# Altium schematic sheet SmartSocket V1.0.SchDoc (part 2 of 3)
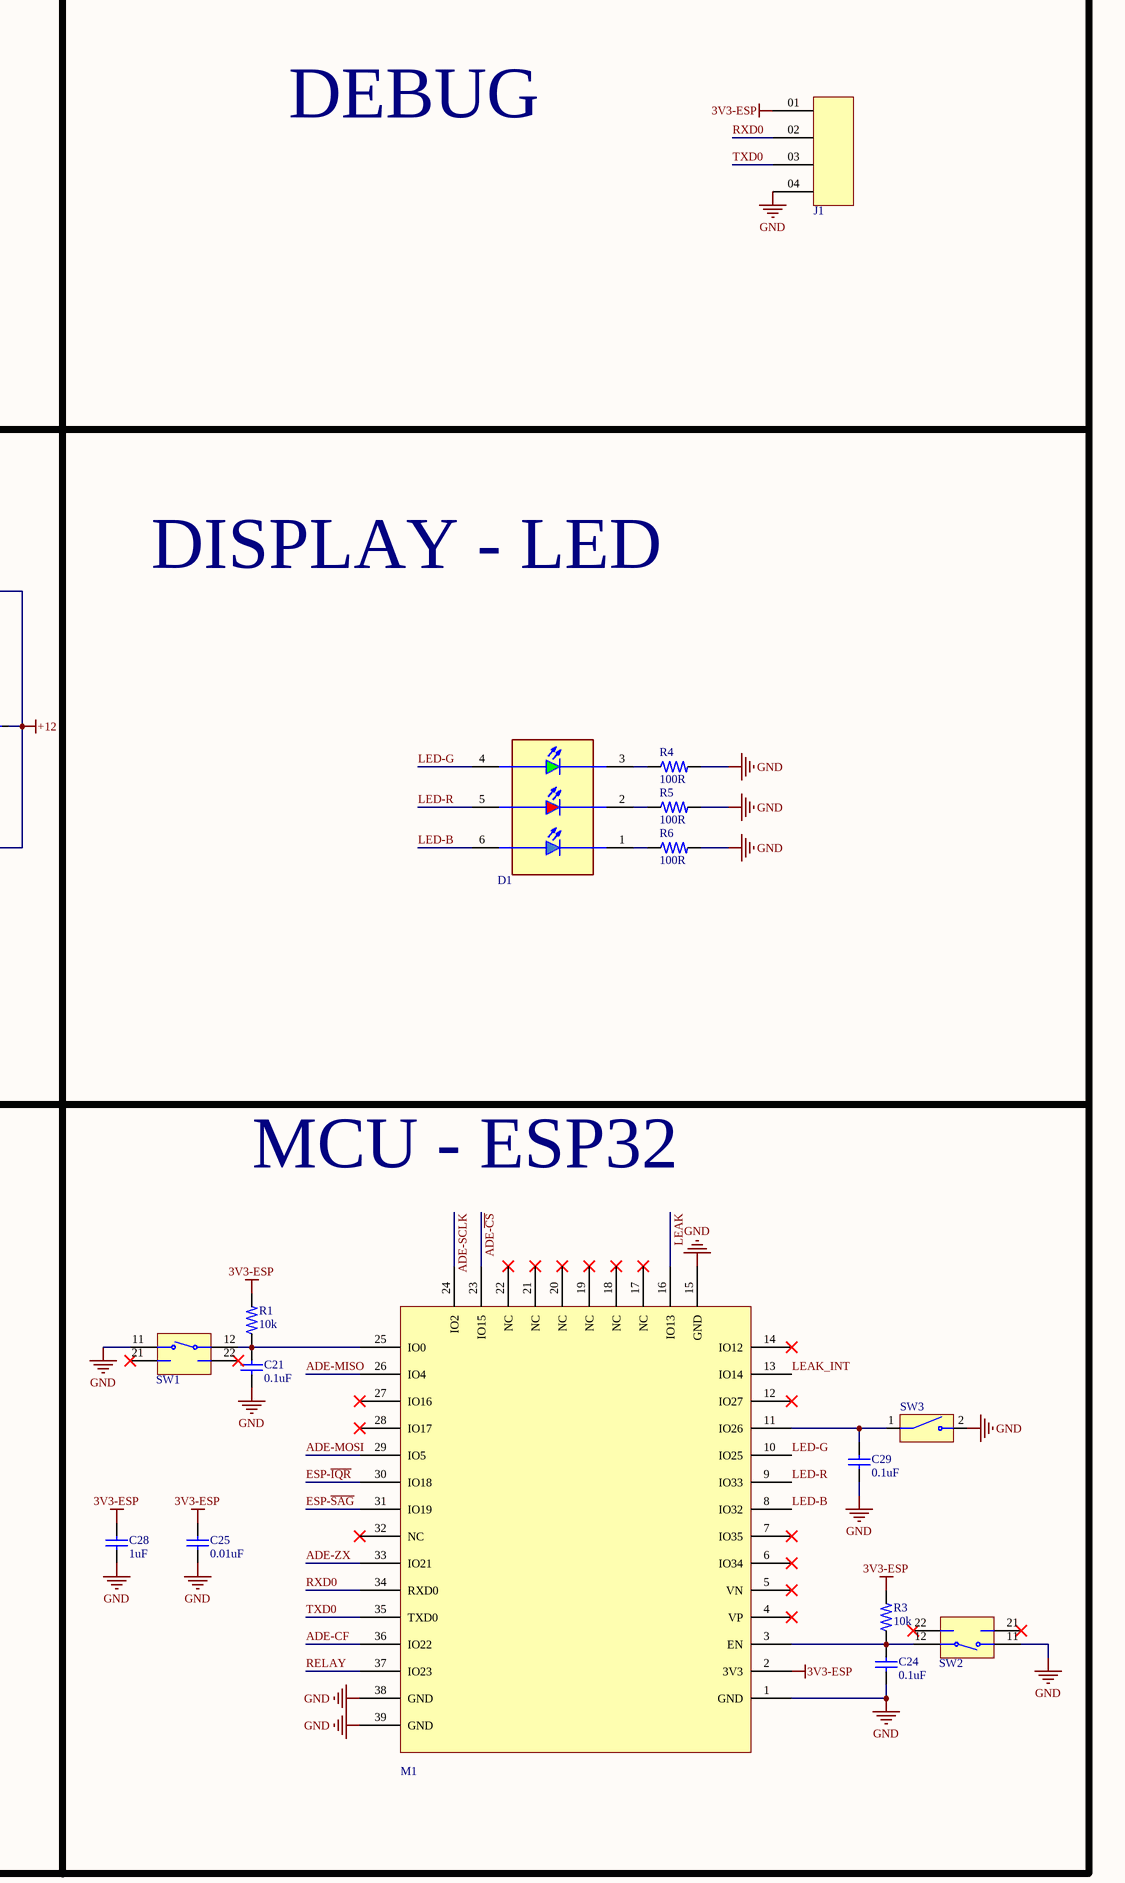
[diagram p2: SmartSocket V1.0.SchDoc, right]
## Library data of the parts
C1 C5 = CAP; 220uF; 16V; SMD; 16SVPK220M: Cap Aluminum Polymer 220uF 16VDC 20% (6.3 X 5.9mm) SMD 0.022 Ohm 1040mA 1000h 125C T/R; Manufacturer: Panasonic; Voltage Rating: 16V; ESR (Equivalent Series Resistance): 22mR; Dissipation Factor: 12%; Leakage Current: 704uA; Ripple Current: 3.3A; Designer: TVBac; Supplier: Mouser; Supplier Part Number: 667-16SVPK220M; Manufacturer Part Number: 16SVPK220M; RoHS: Yes; Category: Polymer Capacitors; Stock: 2355; Pricing: 1=1.29, 10=0.794, 50=0.794, 100=0.723, 1000=0.489, 10000=0.45 (USD); Mounting Technology: Surface Mount; Case/Package: Radial; Material: Polymer; Min Operating Temperature: -55°C; Max Operating Temperature: 125°C; Packaging: Cut Tape; Tolerance: 20%; Series: OS-CON™, SVPK; Voltage Rating (DC): 16V; Height: 6mm; ComponentLink1URL: https://industrial.panasonic.com/cdbs/www-data/pdf/AAB8000/AAB8000C226.pdf?src-supplier=Digikey; ComponentLink1Description: https://industrial.panasonic.com/cdbs/www-data/pdf/AAB8000/AAB8000C226.pdf?src-supplier=Digikey; ComponentLink2URL: https://datasheet.octopart.com/16SVPK220M-Panasonic-datasheet-136612383.pdf?src-supplier=Element14; ComponentLink2Description: https://datasheet.octopart.com/16SVPK220M-Panasonic-datasheet-136612383.pdf?src-supplier=Element14; ComponentLink3URL: https://datasheet.octopart.com/16SVPK220M-Panasonic-datasheet-142271499.pdf?src-supplier=Electro+Sonic; ComponentLink3Description: https://datasheet.octopart.com/16SVPK220M-Panasonic-datasheet-142271499.pdf?src-supplier=Electro+Sonic; ComponentLink4URL: https://datasheet.octopart.com/16SVPK220M-Panasonic-datasheet-151949914.pdf?src-supplier=TME; ComponentLink4Description: https://datasheet.octopart.com/16SVPK220M-Panasonic-datasheet-151949914.pdf?src-supplier=TME; ComponentLink5Description: Link Digikey; ComponentLink5URL: https://www.digikey.com/en/products/detail/panasonic-electronic-components/16SVPK220M/9765095
C2 = CAP; 0.1uF; 50V; 0603; SMD; CC0603JRX7R9BB104: Multilayer Ceramic Capacitor, 0.1 uF, 50 V, ï¿½ 5%, X7R, 0603 [1608 Metric]; Manufacturer: Yageo; Material: 4241ConductorMaterial; Designer: TVBac; Supplier: Digikey; Supplier Part Number: 311-1779-1-ND; Manufacturer Part Number: CC0603JRX7R9BB104; RoHS: Yes; Category: Ceramic Capacitors; Stock: 376318; Pricing: 1=0.1, 10=0.07, 50=0.04, 100=0.031, 500=0.02334, 1000=0.01833, 4000=0.01533, 8000=0.014, 12000=0.01333, 28000=0.01267, 100000=0.00917, 200000=0.00887, 400000=0.00833 (USD); Pins: 2NUMBER; Lead Free: 5697LeadFree; Halogen Free: 5694HalogenFree; ComponentLink1URL: https://datasheet.ciiva.com/11465/upy-gphc-x7r-6-3v-to-50v-8-11465038.pdf?src-supplier=Avnet; ComponentLink1Description: https://datasheet.ciiva.com/11465/upy-gphc-x7r-6-3v-to-50v-8-11465038.pdf?src-supplier=Avnet; ComponentLink2Description: Link Digikey; ComponentLink2URL: https://www.digikey.com/en/products/detail/yageo/CC0603JRX7R9BB104/5195188
C3 C4 = CAP; TH; 2.2uF; 400V; ECA-2GM2R2: Cap Aluminum Lytic 2.2uF 400V 20% (8 X 11.5mm) Radial 3.5mm 50mA 2000h 85C Automotive Bulk; Manufacturer: Panasonic; Designer: TVBac; Supplier: Mouser; Supplier Part Number: 667-ECA-2GM2R2; Manufacturer Part Number: ECA-2GM2R2; RoHS: Yes; Category: Aluminum Electrolytic Capacitors; Stock: 1247; Pricing: 1=0.45, 10=0.221, 50=0.221, 100=0.142, 1000=0.119, 10000=0.096 (USD); Pins: 2NUMBER; Lead Free: 5697LeadFree; ComponentLink1URL: https://datasheet.ciiva.com/48522/radial-m-eng-tds-48522426.pdf?src-supplier=Distrelec; ComponentLink1Description: https://datasheet.ciiva.com/48522/radial-m-eng-tds-48522426.pdf?src-supplier=Distrelec; ComponentLink2Description: Link Digikey; ComponentLink2URL: https://www.digikey.com/en/products/detail/panasonic-electronic-components/ECA-2GM2R2/2688912
C6 C17 C27 = CAP; CAP_TAN; 10uF; 10V; T491A106M010AT: Capacitor, Tantalum, Solid, Polarized, 10 V, 10 Uf, Surface Mount, 1206, Lead Free; Manufacturer: KEMET; Tolerance: 20%; ESR (Equivalent Series Resistance): 4R; Voltage Rating: 10V; Leakage Current: 1uA; Polarity: Polar; Dissipation Factor: 6%; Ripple Current: 137mA; Designer: TVBac; Supplier: Mouser; Supplier Part Number: 80-T491A106M010; Manufacturer Part Number: T491A106M010AT; RoHS: Yes; Category: Tantalum Capacitors; Stock: 78299; Pricing: 1=0.29, 10=0.152, 50=0.152, 100=0.098, 1000=0.083, 2000=0.076, 10000=0.071, 50000=0.069 (USD); Mounting Technology: Surface Mount,PCB; Case/Package: 1206; Pins: 2; Case Code (Metric): 3216; Case Code (Imperial): 1206; Weight: 0.000571oz; Dielectric Material: Tantalum; Min Operating Temperature: -55°C; Max Operating Temperature: 125°C; Packaging: Tape and Reel; Voltage Rating (DC): 10V; Termination: SMD/SMT; Voltage: 10V; Features: General Purpose; Series: T491; Construction: Flat; Length: 3.2mm; Width: 1.6mm; Height: 1.6mm; Depth: 1.6mm; Lead Pitch: 1.2mm; Size: 1.6mm; Reach SVHC Compliant: No; Lead Free: Lead Free; RoHS Compliant: Yes; ComponentLink1URL: https://datasheet.ciiva.com/27052/1573273-27052561.pdf?src-supplier=Jameco; ComponentLink1Description: https://datasheet.ciiva.com/27052/1573273-27052561.pdf?src-supplier=Jameco; ComponentLink2URL: https://datasheet.ciiva.com/257/kem-t2005-t491-257587.pdf?src-supplier=Digikey; ComponentLink2Description: https://datasheet.ciiva.com/257/kem-t2005-t491-257587.pdf?src-supplier=Digikey; ComponentLink3URL: https://datasheet.ciiva.com/7668/kem-t2005-t491-7668140.pdf?src-supplier=Element14; ComponentLink3Description: https://datasheet.ciiva.com/7668/kem-t2005-t491-7668140.pdf?src-supplier=Element14; ComponentLink4URL: https://datasheet.ciiva.com/257/kem-t2005-t491-257588.pdf?src-supplier=Digikey; ComponentLink4Description: https://datasheet.ciiva.com/257/kem-t2005-t491-257588.pdf?src-supplier=Digikey; ComponentLink5URL: https://datasheet.ciiva.com/257/kem-t2005-t491-257589.pdf?src-supplier=Digikey; ComponentLink5Description: https://datasheet.ciiva.com/257/kem-t2005-t491-257589.pdf?src-supplier=Digikey; ComponentLink6URL: https://datasheet.ciiva.com/14601/70095774-14601994.pdf?src-supplier=Allied+Electronics; ComponentLink6Description: https://datasheet.ciiva.com/14601/70095774-14601994.pdf?src-supplier=Allied+Electronics; ComponentLink7URL: https://datasheet.ciiva.com/14602/70095774-14602172.pdf?src-supplier=Allied+Electronics; ComponentLink7Description: https://datasheet.ciiva.com/14602/70095774-14602172.pdf?src-supplier=Allied+Electronics; ComponentLink8URL: https://datasheet.ciiva.com/12910/kem-t2005-t491-12910559.pdf?src-supplier=Mouser; ComponentLink8Description: https://datasheet.ciiva.com/12910/kem-t2005-t491-12910559.pdf?src-supplier=Mouser; ComponentLink9Description: Link Digikey; ComponentLink9URL: https://www.digikey.com/en/products/detail/kemet/T491A106M010AT/818547
C7 = CAP; 220uF; 10V; SMD; 10SVPE220M: Cap Aluminum Polymer 220uF 10VDC 20%( 6.3 X 5.9mm) SMD 0.02 Ohm 2700mA 2000h 105C T/R; Manufacturer: Panasonic; Voltage Rating: 10V; ESR (Equivalent Series Resistance): 20mR; Ripple Current: 2.7A; Leakage Current: 500uA; Life (Hours): 2000Hour; Dissipation Factor: 12%; Designer: TVBac; Supplier: Mouser; Supplier Part Number: 667-10SVPE220M; Manufacturer Part Number: 10SVPE220M; RoHS: Yes; Category: Polymer Capacitors; Stock: 1969; Pricing: 1=1.66, 10=1.53, 50=1.44, 100=1.19, 1000=0.857, 10000=0.768 (USD); Mounting Technology: Surface Mount; Case/Package: Radial; Pins: 6; Min Operating Temperature: -55°C; Max Operating Temperature: 105°C; Package Quantity: 1000; Packaging: Tape and Reel; Tolerance: 20%; Voltage Rating (DC): 10V; Ripple Current (AC): 2.7A; Termination: SMD/SMT; Voltage: 10V; Series: OS-CON™, SVPE; Construction: Cylindrical; Diameter: 6.3mm; Length: 5.9mm; Height: 5.9mm; Reach SVHC Compliant: No; Lead Free: Lead Free; RoHS Compliant: Yes; ComponentLink1URL: https://datasheet.ciiva.com/25767/1734359-25767468.pdf?src-supplier=Farnell; ComponentLink1Description: https://datasheet.ciiva.com/25767/1734359-25767468.pdf?src-supplier=Farnell; ComponentLink2URL: https://datasheet.ciiva.com/22746/1734359-22746158.pdf?src-supplier=Element14; ComponentLink2Description: https://datasheet.ciiva.com/22746/1734359-22746158.pdf?src-supplier=Element14; ComponentLink3Description: Link Digikey; ComponentLink3URL: https://www.digikey.com/en/products/detail/panasonic-electronic-components/10SVPE220M/4204777
C8 C9 C18 = CAP; 0.1uF; 16V; 0603; SMD; CC0603KRX7R7BB104: 0603 0.1 uF 16 V ±10 % Tolerance X7R SMT Multilayer Ceramic Capacitor; Manufacturer: Yageo; Insulation Resistance: 100GR; Designer: TVBac; Supplier: Digikey; Supplier Part Number: 311-1088-1-ND; Manufacturer Part Number: CC0603KRX7R7BB104; RoHS: Yes; Category: Ceramic Capacitors; Stock: 8705780; Pricing: 1=0.1, 10=0.042, 50=0.0238, 100=0.0185, 500=0.01392, 1000=0.01094, 4000=0.00915, 8000=0.00836, 12000=0.00796, 28000=0.00756, 100000=0.00547, 200000=0.00529, 400000=0.00497 (USD); Mounting Technology: Surface Mount; Case/Package: 0603; Pins: 2; Case Code (Metric): 1608; Case Code (Imperial): 0603; Material: Ceramic; Min Operating Temperature: -55°C; Max Operating Temperature: 125°C; Voltage Rating: 16V; Tolerance: 10%; Voltage Rating (DC): 16V; Package Quantity: 1; Packaging: Tape and Reel; Dielectric: X7R; Termination: SMD/SMT; Voltage: 16V; Series: CC; Length: 1.6mm; Width: 0.031inch; Height: 0.8mm; Thickness: 0.035inch; Depth: 0.8mm; Radiation Hardening: No; Reach SVHC Compliant: No; Lead Free: Lead Free; Halogen Free: Halogen Free; RoHS Compliant: Yes; ComponentLink1URL: https://datasheet.ciiva.com/11786/0900766b80d84f1d-11786077.pdf?src-supplier=Rs; ComponentLink1Description: https://datasheet.ciiva.com/11786/0900766b80d84f1d-11786077.pdf?src-supplier=Rs; ComponentLink2URL: https://datasheet.ciiva.com/8033/70765-8033799.pdf?src-supplier=Element14; ComponentLink2Description: https://datasheet.ciiva.com/8033/70765-8033799.pdf?src-supplier=Element14; ComponentLink3URL: https://datasheet.ciiva.com/7978/1489800-7978141.pdf?src-supplier=Element14; ComponentLink3Description: https://datasheet.ciiva.com/7978/1489800-7978141.pdf?src-supplier=Element14; ComponentLink4URL: https://datasheet.ciiva.com/28450/1489800-28450552.pdf?src-supplier=Element14; ComponentLink4Description: https://datasheet.ciiva.com/28450/1489800-28450552.pdf?src-supplier=Element14; ComponentLink5URL: https://datasheet.ciiva.com/46430/1734573-46430156.pdf?src-supplier=Element14; ComponentLink5Description: https://datasheet.ciiva.com/46430/1734573-46430156.pdf?src-supplier=Element14; ComponentLink6URL: https://datasheet.ciiva.com/144/mlccorderingcode-144183.pdf?src-supplier=Digikey; ComponentLink6Description: https://datasheet.ciiva.com/144/mlccorderingcode-144183.pdf?src-supplier=Digikey; ComponentLink7URL: https://datasheet.ciiva.com/144/mlccorderingcode-144182.pdf?src-supplier=Digikey; ComponentLink7Description: https://datasheet.ciiva.com/144/mlccorderingcode-144182.pdf?src-supplier=Digikey; ComponentLink8URL: https://datasheet.ciiva.com/144/mlccorderingcode-144184.pdf?src-supplier=Digikey; ComponentLink8Description: https://datasheet.ciiva.com/144/mlccorderingcode-144184.pdf?src-supplier=Digikey; ComponentLink9URL: https://datasheet.ciiva.com/8033/1734573-8033797.pdf?src-supplier=Element14; ComponentLink9Description: https://datasheet.ciiva.com/8033/1734573-8033797.pdf?src-supplier=Element14; ComponentLink10URL: https://datasheet.ciiva.com/13395/upy-gphc-x7r-6-3v-to-50v-8-13395674.pdf?src-supplier=Mouser; ComponentLink10Description: https://datasheet.ciiva.com/13395/upy-gphc-x7r-6-3v-to-50v-8-13395674.pdf?src-supplier=Mouser; ComponentLink11URL: https://datasheet.ciiva.com/11464/upy-gphc-x7r-6-3v-to-50v-8-11464735.pdf?src-supplier=Avnet; ComponentLink11Description: https://datasheet.ciiva.com/11464/upy-gphc-x7r-6-3v-to-50v-8-11464735.pdf?src-supplier=Avnet; ComponentLink12URL: https://datasheet.ciiva.com/15165/getdatasheetpartid-63554-15165387.pdf?src-supplier=Verical; ComponentLink12Description: https://datasheet.ciiva.com/15165/getdatasheetpartid-63554-15165387.pdf?src-supplier=Verical; ComponentLink13Description: Link Digikey; ComponentLink13URL: https://www.digikey.com/en/products/detail/yageo/CC0603KRX7R7BB104/302822
C10 C13 = CAP; 22pF; 50V; SMD; CC0603FRNPO9BN220: Multilayer Ceramic Capacitor, 22 pF, 50 V, ï¿½ 1%, C0G (NP0), 0603 [1608 Metric]; Manufacturer: Yageo; Designer: TVBac; Supplier: Future Electronics; Supplier Part Number: 1000074; Manufacturer Part Number: CC0603FRNPO9BN220; RoHS: Yes; Category: Ceramic Capacitors; Stock: 144000; Pricing: 4000=0.0159, 12000=0.0156, 20000=0.0154, 80000=0.0149, 120000=0.0147 (USD); Lead Free: 5697LeadFree; Halogen Free: 5694HalogenFree; ComponentLink1URL: https://datasheet.ciiva.com/13211/upy-gp-np0-16v-to-50v-8-13211061.pdf?src-supplier=Mouser; ComponentLink1Description: https://datasheet.ciiva.com/13211/upy-gp-np0-16v-to-50v-8-13211061.pdf?src-supplier=Mouser; ComponentLink2Description: Link Digikey; ComponentLink2URL: https://www.digikey.com/en/products/detail/yageo/CC0603FRNPO9BN220/5883497
C11 C12 C14-C16 C19 = CAP; 0.033uF; 33nF; 0603; 16V; C0603C333J4REC7411: Multilayer Ceramic Capacitors MLCC - SMD/SMT 16V 0.033uF X7R 0603 5%; Manufacturer: KEMET; Designer: TVBac; Supplier: Mouser; Supplier Part Number: 80-C0603C333J4RECLR; Manufacturer Part Number: C0603C333J4REC7411; RoHS: Yes; Category: Ceramic Capacitors; Stock: 17910; Pricing: 1=0.13, 10=0.057, 50=0.057, 100=0.033, 1000=0.025, 2500=0.022, 10000=0.02, 15000=0.018, 45000=0.017, 90000=0.014 (USD); ComponentLink1URL: https://api.kemet.com/component-edge/download/datasheet/C0603C333J4REC7411.pdf?src-supplier=Digikey; ComponentLink1Description: https://api.kemet.com/component-edge/download/datasheet/C0603C333J4REC7411.pdf?src-supplier=Digikey; ComponentLink2Description: Link Digikey; ComponentLink2URL: https://www.digikey.com/en/products/detail/kemet/C0603C333J4REC7411/8645086
C20 = CAP; 10uF; 10V; 0805; C0805C106K9PACTU: Multilayer Ceramic Capacitor, 10 uF, 6.3 V, ï¿½ 10%, X5R, 0805 [2012 Metric]; Manufacturer: KEMET; Material: 4241ConductorMaterial; Dissipation Factor: 5%; Designer: TVBac; Supplier: Mouser; Supplier Part Number: 80-C0805C106K9P; Manufacturer Part Number: C0805C106K9PACTU; RoHS: Yes; Category: Ceramic Capacitors; Stock: 133022; Pricing: 1=0.12, 10=0.074, 50=0.074, 100=0.044, 1000=0.033, 3000=0.026, 9000=0.025, 10000=0.025, 24000=0.023, 45000=0.022, 99000=0.019 (USD); Mounting Technology: Surface Mount; Case/Package: 0805; Pins: 2; Case Code (Imperial): 0805; Case Code (Metric): 2012; Contact Material: Tin; Dielectric Material: 4241ConductorMaterial; Min Operating Temperature: -55°C; Max Operating Temperature: 85°C; Tolerance: 10%; Packaging: Tape and Reel; Package Quantity: 3000; Voltage Rating: 6.3V; Voltage Rating (DC): 6.3V; Dielectric: X5R; Termination: SMD/SMT; Series: SMD Comm X5R; Construction: Flat; Voltage Rating (AC): 6.3V; Length: 2mm; Width: 1.2mm; Height: 1.25mm; Depth: 1.25mm; Lead Pitch: 0.75mm; Radiation Hardening: No; Reach SVHC Compliant: No; RoHS Compliant: Yes; Lead Free: 5697LeadFree; ComponentLink1URL: https://datasheet.ciiva.com/7842/kem-c1006-x5r-smd-7842200.pdf?src-supplier=Element14; ComponentLink1Description: https://datasheet.ciiva.com/7842/kem-c1006-x5r-smd-7842200.pdf?src-supplier=Element14; ComponentLink2URL: https://datasheet.ciiva.com/7842/kem-c1006-x5r-smd-7842201.pdf?src-supplier=Element14; ComponentLink2Description: https://datasheet.ciiva.com/7842/kem-c1006-x5r-smd-7842201.pdf?src-supplier=Element14; ComponentLink3URL: https://datasheet.ciiva.com/18193/getdatasheetpartid-320652-18193500.pdf?src-supplier=Verical; ComponentLink3Description: https://datasheet.ciiva.com/18193/getdatasheetpartid-320652-18193500.pdf?src-supplier=Verical; ComponentLink4Description: Link Digikey; ComponentLink4URL: https://www.digikey.com/en/products/detail/kemet/C0805C106K9PAC7800/551604
C21 C24 C29 = CAP; 0.1uF; 25V; 0603; SMD; CC0603JRX7R8BB104: Multilayer Ceramic Capacitor, 0.1 uF, 25 V, ï¿½ 5%, X7R, 0603 [1608 Metric]; Manufacturer: Yageo; Designer: TVBac; Supplier: Digikey; Supplier Part Number: 311-1777-1-ND; Manufacturer Part Number: CC0603JRX7R8BB104; RoHS: Yes; Category: Ceramic Capacitors; Stock: 449287; Pricing: 1=0.1, 10=0.068, 50=0.0408, 100=0.0321, 500=0.02372, 1000=0.01964, 4000=0.01672, 8000=0.01555, 12000=0.01478, 28000=0.014, 100000=0.0106, 200000=0.01034, 400000=0.00972 (USD); Mounting Technology: Surface Mount; Case/Package: 0603; Case Code (Imperial): 0603; Case Code (Metric): 1608; Weight: 7.1E-05oz; Min Operating Temperature: -55°C; Max Operating Temperature: 125°C; Voltage Rating: 25V; Voltage Rating (DC): 25V; Tolerance: 5%; Packaging: Tape and Reel; Dielectric: X7R; Termination: SMD/SMT; Series: CC; Construction: Flat; Length: 1.6mm; Width: 0.031inch; Height: 0.8mm; Thickness: 0.035inch; Lead Free: Lead Free; Halogen Free: Halogen Free; RoHS Compliant: Yes; ComponentLink1URL: https://datasheet.ciiva.com/11465/upy-gphc-x7r-6-3v-to-50v-8-11465031.pdf?src-supplier=Avnet; ComponentLink1Description: https://datasheet.ciiva.com/11465/upy-gphc-x7r-6-3v-to-50v-8-11465031.pdf?src-supplier=Avnet; ComponentLink2Description: Link Digikey; ComponentLink2URL: https://www.digikey.com/en/products/detail/yageo/CC0603JRX7R8BB104/5195186
C22 = CAP; TH; 0.001uF; 50V; FA28NP01H102JNU06: Capacitor Ceramic 0.001uF 50V C0G 5% 5mm T/R; Manufacturer: TDK; Lead/Base Style: Kinked; Designer: TVBac; Supplier: Digikey; Supplier Part Number: 445-180768-1-ND; Manufacturer Part Number: FA28NP01H102JNU06; Category: Ceramic Capacitors; Stock: 2260; Pricing: 1=0.37, 10=0.22, 50=0.1588, 100=0.1398, 500=0.1073, 1000=0.09719 (USD); Mounting Technology: Through Hole; Case/Package: Radial; Min Operating Temperature: -55°C; Max Operating Temperature: 150°C; Packaging: Tape and Reel; Voltage Rating: 50V; Tolerance: 5%; Features: High Temperature; Series: FA; Length: 0.157inch; Width: 0.098inch; Height - Seated (Max): 0.217inch; Lead Pitch: 0.197inch; Ratings: AEC-Q200; RoHS Compliant: Yes; ComponentLink1URL: https://product.tdk.com/info/en/catalog/datasheets/leadmlcc_halogenfree_fa150_en.pdf?src-supplier=Digikey; ComponentLink1Description: https://product.tdk.com/info/en/catalog/datasheets/leadmlcc_halogenfree_fa150_en.pdf?src-supplier=Digikey; ComponentLink2URL: https://datasheet.octopart.com/FA28NP01H102JNU06-TDK-datasheet-155378142.pdf?src-supplier=TDK; ComponentLink2Description: https://datasheet.octopart.com/FA28NP01H102JNU06-TDK-datasheet-155378142.pdf?src-supplier=TDK; ComponentLink3URL: https://datasheet.octopart.com/FA28NP01H102JNU06-TDK-datasheet-154546129.pdf?src-supplier=Farnell; ComponentLink3Description: https://datasheet.octopart.com/FA28NP01H102JNU06-TDK-datasheet-154546129.pdf?src-supplier=Farnell; ComponentLink4Description: Link Digikey; ComponentLink4URL: https://www.digikey.com/en/products/detail/tdk-corporation/FA28NP01H102JNU06/5866347
C23 = CAP; 220uF; 25V; SMD; EEH-ZA1E221P: Cap Aluminum 220uF 25V 20% (8 X 10.2mm) SMD 0.027 Ohm 2300mA 5000h 105 C Embossed T/R; Manufacturer: Panasonic; ESR (Equivalent Series Resistance): 27mR; Ripple Current: 2.3A; Life (Hours): 10000Hour; Leakage Current: 55uA; Dissipation Factor: 14%; Lead Diameter: 0.9mm; Designer: TVBac; Supplier: Mouser; Supplier Part Number: 667-EEH-ZA1E221P; Manufacturer Part Number: EEH-ZA1E221P; RoHS: Yes; Category: Polymer Capacitors; Stock: 1873; Pricing: 1=1.51, 10=0.895, 50=0.895, 100=0.746, 500=0.622, 1000=0.598, 2500=0.524, 5000=0.511, 10000=0.482 (USD); Mounting Technology: Surface Mount,PCB; Case/Package: Radial; Material: Polymer; Min Operating Temperature: -55°C; Max Operating Temperature: 105°C; Packaging: Tape and Reel; Voltage Rating: 25V; Tolerance: 20%; Package Quantity: 500; Ripple Current (AC): 2.3A; Voltage Rating (DC): 25V; Termination: SMD/SMT; Voltage: 25V; Series: ZA; Technology: HYBRID; Construction: Cylindrical; Diameter: 8mm; Length: 10.2mm; Height: 10.2mm; Lead Pitch: 3.1mm; Ratings: AEC-Q200; Radiation Hardening: No; Reach SVHC Compliant: No; Lead Free: Lead Free; RoHS Compliant: Yes; ComponentLink1URL: https://datasheet.ciiva.com/25613/0900766b81233638-25613815.pdf?src-supplier=Rs; ComponentLink1Description: https://datasheet.ciiva.com/25613/0900766b81233638-25613815.pdf?src-supplier=Rs; ComponentLink2URL: https://datasheet.ciiva.com/6301/aba0000ce136-6301615.pdf?src-supplier=Digikey; ComponentLink2Description: https://datasheet.ciiva.com/6301/aba0000ce136-6301615.pdf?src-supplier=Digikey; ComponentLink3URL: https://datasheet.ciiva.com/10327/aba0000ce136-10327230.pdf?src-supplier=Avnet; ComponentLink3Description: https://datasheet.ciiva.com/10327/aba0000ce136-10327230.pdf?src-supplier=Avnet; ComponentLink4URL: https://datasheet.ciiva.com/11677/aba0000ce136-11677614.pdf?src-supplier=Avnet; ComponentLink4Description: https://datasheet.ciiva.com/11677/aba0000ce136-11677614.pdf?src-supplier=Avnet; ComponentLink5URL: https://datasheet.ciiva.com/32372/86aba0000ce136-32372729.pdf?src-supplier=Onlinecomponents.com; ComponentLink5Description: https://datasheet.ciiva.com/32372/86aba0000ce136-32372729.pdf?src-supplier=Onlinecomponents.com; ComponentLink6URL: https://datasheet.ciiva.com/30515/70314667-30515143.pdf?src-supplier=Allied+Electronics; ComponentLink6Description: https://datasheet.ciiva.com/30515/70314667-30515143.pdf?src-supplier=Allied+Electronics; ComponentLink7URL: https://datasheet.ciiva.com/48540/eehza-eng-tds-48540965.pdf?src-supplier=Distrelec; ComponentLink7Description: https://datasheet.ciiva.com/48540/eehza-eng-tds-48540965.pdf?src-supplier=Distrelec; ComponentLink8URL: https://datasheet.ciiva.com/22730/1536543-22730550.pdf?src-supplier=Element14; ComponentLink8Description: https://datasheet.ciiva.com/22730/1536543-22730550.pdf?src-supplier=Element14; ComponentLink9Description: Link Digikey; ComponentLink9URL: https://www.digikey.com/en/products/detail/panasonic-electronic-components/EEH-ZA1E221P/3088116
C25 C26 = CAP; 0.1uF; 10V; 0603; SMD; CC0603KRX7R6BB104: Multilayer Ceramic Capacitor, 0.1 uF, 10 V, ± 10%, X7R, 0603 [1608 Metric]; Manufacturer: Yageo; Material: 4241ConductorMaterial; Designer: TVBac; Supplier: Digikey; Supplier Part Number: 311-4055-1-ND; Manufacturer Part Number: CC0603KRX7R6BB104; RoHS: Yes; Category: Ceramic Capacitors; Stock: 113177; Pricing: 1=0.1, 10=0.067, 50=0.0398, 100=0.0314, 500=0.02316, 1000=0.01918, 4000=0.01633, 8000=0.01519, 12000=0.01443, 28000=0.01367, 100000=0.01035, 200000=0.0101, 400000=0.00949 (USD); Lead Free: 5697LeadFree; Halogen Free: 5694HalogenFree; ComponentLink1URL: https://datasheet.ciiva.com/11586/upy-gphc-x7r-6-3v-to-50v-8-11586327.pdf?src-supplier=Avnet; ComponentLink1Description: https://datasheet.ciiva.com/11586/upy-gphc-x7r-6-3v-to-50v-8-11586327.pdf?src-supplier=Avnet; ComponentLink2Description: Link Digikey; ComponentLink2URL: https://www.digikey.com/en/products/detail/yageo/CC0603KRX7R6BB104/5883741
C28 = CAP; 1uF; 16V; 0603; SMD; CC0603KRX7R7BB105: 0603 1 uF 16 V ±10 % Tolerance X7R SMT Multilayer Ceramic Capacitor; Manufacturer: Yageo; Material: 4241ConductorMaterial; Dissipation Factor: 5%; Designer: TVBac; Supplier: Digikey; Supplier Part Number: 311-1446-1-ND; Manufacturer Part Number: CC0603KRX7R7BB105; RoHS: Yes; Category: Ceramic Capacitors; Stock: 9165861; Pricing: 1=0.1, 10=0.066, 50=0.0392, 100=0.0308, 500=0.02274, 1000=0.01882, 4000=0.01785, 8000=0.01626, 12000=0.01545, 20000=0.01456, 28000=0.01404, 40000=0.01353, 100000=0.01313 (USD); Mounting Technology: Surface Mount; Case/Package: 0603; Pins: 2; Case Code (Metric): 1608; Case Code (Imperial): 0603; Min Operating Temperature: -55°C; Max Operating Temperature: 125°C; Tolerance: 10%; Voltage Rating: 16V; Package Quantity: 1; Packaging: Tape and Reel; Voltage Rating (DC): 16V; Dielectric: X7R; Termination: SMD/SMT; Voltage: 16V; Series: CC; Construction: Flat; Length: 1.6mm; Width: 0.031inch; Height: 0.8mm; Thickness: 0.035inch; Depth: 0.8mm; Radiation Hardening: No; RoHS Compliant: Yes; Reach SVHC Compliant: Unknown; Lead Free: 5697LeadFree; Halogen Free: 5694HalogenFree; ComponentLink1URL: https://datasheet.ciiva.com/8033/1734573-8033801.pdf?src-supplier=Element14; ComponentLink1Description: https://datasheet.ciiva.com/8033/1734573-8033801.pdf?src-supplier=Element14; ComponentLink2URL: https://datasheet.ciiva.com/8033/1734573-8033800.pdf?src-supplier=Element14; ComponentLink2Description: https://datasheet.ciiva.com/8033/1734573-8033800.pdf?src-supplier=Element14; ComponentLink3URL: https://datasheet.ciiva.com/7978/1489800-7978143.pdf?src-supplier=Element14; ComponentLink3Description: https://datasheet.ciiva.com/7978/1489800-7978143.pdf?src-supplier=Element14; ComponentLink4URL: https://datasheet.ciiva.com/28450/1489800-28450557.pdf?src-supplier=Element14; ComponentLink4Description: https://datasheet.ciiva.com/28450/1489800-28450557.pdf?src-supplier=Element14; ComponentLink5URL: https://datasheet.ciiva.com/176/mlccorderingcode-176789.pdf?src-supplier=Digikey; ComponentLink5Description: https://datasheet.ciiva.com/176/mlccorderingcode-176789.pdf?src-supplier=Digikey; ComponentLink6URL: https://datasheet.ciiva.com/176/mlccorderingcode-176788.pdf?src-supplier=Digikey; ComponentLink6Description: https://datasheet.ciiva.com/176/mlccorderingcode-176788.pdf?src-supplier=Digikey; ComponentLink7URL: https://datasheet.ciiva.com/176/mlccorderingcode-176790.pdf?src-supplier=Digikey; ComponentLink7Description: https://datasheet.ciiva.com/176/mlccorderingcode-176790.pdf?src-supplier=Digikey; ComponentLink8URL: https://datasheet.ciiva.com/5425/upy-gphc-x7r-6-3v-to-50v-8-12304-5425495.pdf?src-supplier=Mouser; ComponentLink8Description: https://datasheet.ciiva.com/5425/upy-gphc-x7r-6-3v-to-50v-8-12304-5425495.pdf?src-supplier=Mouser; ComponentLink9Description: Link Digikey; ComponentLink9URL: https://www.digikey.com/en/products/detail/yageo/CC0603KRX7R7BB105/2833611?s=N4IgTCBcDaIMJwAwDZEGYDSAlAGgdizwCEiBGRAVhAF0BfIA
C32 = CAP; 0.01uF; 25V; 0603; SMD; CC0603JRX7R8BB103: Surface Mount Ceramic Multilayer Capacitor 0.01uF 5% X7R 25V 0603 Paper T/R; Manufacturer: Yageo; Designer: TVBac; Supplier: Digikey; Supplier Part Number: 311-3995-1-ND; Manufacturer Part Number: CC0603JRX7R8BB103; RoHS: Yes; Category: Ceramic Capacitors; Stock: 4379; Pricing: 1=0.1, 10=0.061, 50=0.035, 100=0.0271, 500=0.02036, 1000=0.016 (USD); ComponentLink1URL: https://datasheet.ciiva.com/11465/upy-gphc-x7r-6-3v-to-50v-8-11465030.pdf?src-supplier=Avnet; ComponentLink1Description: https://datasheet.ciiva.com/11465/upy-gphc-x7r-6-3v-to-50v-8-11465030.pdf?src-supplier=Avnet; ComponentLink2Description: Link Digikey; ComponentLink2URL: https://www.digikey.com/en/products/detail/yageo/CC0603JRX7R8BB103/5883656
D1 = LED; RGB; SMD; BL-HBXJXGX32L: 5050 PLCC6 Rgb; Manufacturer: American Bright; Designer: TVBac; Supplier: Digikey; Supplier Part Number: BL-HBXJXGX32LCT-ND; Manufacturer Part Number: BL-HBXJXGX32L; RoHS: No; Category: LEDs; Stock: 17028; Pricing: 1=0.63, 10=0.388, 100=0.223 (USD); ComponentLink1URL: http://americanbrightled.com/pdffiles/plcc/BL-HBXJXGX32L.pdf?src-supplier=Digikey; ComponentLink1Description: http://americanbrightled.com/pdffiles/plcc/BL-HBXJXGX32L.pdf?src-supplier=Digikey; ComponentLink2Description: Link Digikey; ComponentLink2URL: https://www.digikey.com/en/products/detail/american-bright-optoelectronics-corporation/BL-HBXJXGX32L/9678124
D2 D5 D7 D8 = DIODE; SMD; 1N4007FLN4007;: Diode Gen Purp 1KV 1A SOD123FL; Manufacturer: Sangdest Microelectronics; Value: 6pF; Max Forward Surge Current (Ifsm): 30A; Max Reverse Current: 5uA; Designer: TVBac; Supplier: Digikey; Supplier Part Number: 1655-1N4007FLCT-ND; Manufacturer Part Number: 1N4007FL; RoHS: No; Category: Diodes; Stock: 332632; Pricing: 1=0.1, 10=0.058, 100=0.039, 500=0.02954, 1000=0.02627 (USD); Min Operating Temperature: -55°C; Max Operating Temperature: 150°C; Forward Current: 1A; Max Repetitive Reverse Voltage (Vrrm): 1kV; Reverse Voltage: 1kV; Height: 1.1mm; ComponentLink1Description: Link Digikey; ComponentLink1URL: https://www.digikey.com/en/products/detail/smc-diode-solutions/1N4007FL/11657817
D3 = DIODE; SMD; ABS10H: Bridge Rectifiers 1A, 1000V, Standard Bridge Rectifier; Manufacturer: Taiwan Semiconductor; Manufacturer Part Number: ABS10H; Designer: TVBac; Supplier: Digikey; Supplier Part Number: 1801-ABS10HCT-ND; Stock: 4817; Pricing: 1=0.49, 10=0.33, 100=0.2241, 500=0.17496, 1000=0.15869, 2000=0.14481 (USD); ComponentLink1Description: Link Digikey; ComponentLink1URL: https://www.digikey.com/en/products/detail/taiwan-semiconductor-corporation/ABS10H/7366098
D4 D6 = DIODE; SMD; SCHOTTKY; SS34-HF: Diode Schottky Si 40V 3A 2-Pin SMA T/R; Manufacturer: Comchip; Designer: TVBac; Supplier: Digikey; Supplier Part Number: 641-2115-1-ND; Manufacturer Part Number: SS34-HF; RoHS: Yes; Category: LDO; Stock: 65957; Pricing: 1=0.46, 10=0.325, 100=0.164, 500=0.14536, 1000=0.11312, 2000=0.10124 (USD); RoHS Compliant: Yes; ComponentLink1URL: http://www.comchiptech.com/admin/files/product/20190514101641.pdf?src-supplier=Digikey; ComponentLink1Description: http://www.comchiptech.com/admin/files/product/20190514101641.pdf?src-supplier=Digikey; ComponentLink2Description: Link Digikey; ComponentLink2URL: https://www.digikey.com/en/products/detail/comchip-technology/SS34-HF/10279693
F1 = FUSE; 20A; 0ADKP9200-RE: Fuse 20A 600VAC 500VDC Time Delay 2-Pin Through Hole; Manufacturer: Bel; Designer: TVBac; Supplier: Digikey; Supplier Part Number: 5923-0ADKP9200-RE-ND; Manufacturer Part Number: 0ADKP9200-RE; RoHS: Yes; Category: Fuses; Stock: 157; Pricing: 1=2.13, 5=1.774, 10=1.64, 50=1.3664, 100=1.2626, 250=1.13684, 500=1.04966, 1000=0.96871, 5000=0.80225 (USD); ComponentLink1URL: https://belfuse.com/resources/Datasheets/CircuitProtection/ds-CP-0adkx-series.pdf?src-supplier=Digikey; ComponentLink1Description: https://belfuse.com/resources/Datasheets/CircuitProtection/ds-CP-0adkx-series.pdf?src-supplier=Digikey; ComponentLink2URL: https://datasheet.octopart.com/0ADKP9200-RE-Bel-Fuse-datasheet-154833970.pdf?src-supplier=Master+Electronics; ComponentLink2Description: https://datasheet.octopart.com/0ADKP9200-RE-Bel-Fuse-datasheet-154833970.pdf?src-supplier=Master+Electronics; ComponentLink3Description: Link Digikey; ComponentLink3URL: https://www.digikey.com/en/products/detail/bel-fuse-inc/0ADKP9200-RE/7404484
F2 = FUSE; 1A; 36911000000: Fuse Subminiature Slow Blow Acting 1A 300V Radial 8.5 X 4 X 8mm Ammo Pack; Manufacturer: Littelfuse Wickmann; DC Cold Resistance: 71.5mR; Blow Characteristic: TIME DELAY; Lead Length: 18.8mm; Designer: TVBac; Supplier: Digikey; Supplier Part Number: F5459CT-ND; Manufacturer Part Number: 36911000000; RoHS: Yes; Category: Fuses; Stock: 1380; Pricing: 1=0.58, 5=0.482, 10=0.446, 50=0.3714, 100=0.3433, 250=0.30924, 500=0.28568, 1400=0.25378, 2800=0.23421, 4200=0.22341, 7000=0.218 (USD); Mounting Technology: Through Hole; Case/Package: Radial; Min Operating Temperature: -40°C; Max Operating Temperature: 85°C; Package Quantity: 1400; Current Rating: 1A; Voltage Rating (AC): 300V; Packaging: Cut Tape; Termination: Radial; Current: 1A; Fuse Current: 1A; Working Voltage: 300V; Fuse Type: Board Mount (Cartridge Style Excluded); Series: TE5® 369; Length: 0.335inch; Width: 0.157inch; Height: 0.315inch; Size: 8mm; Reach SVHC Compliant: No; Lead Free: Lead Free; RoHS Compliant: Yes; ComponentLink1URL: https://datasheet.ciiva.com/7464/littelfuse-fuse-369-series-7464654.pdf?src-supplier=Digikey; ComponentLink1Description: https://datasheet.ciiva.com/7464/littelfuse-fuse-369-series-7464654.pdf?src-supplier=Digikey; ComponentLink2URL: https://datasheet.ciiva.com/16320/littelfuse-fuse-369-16320426.pdf?src-supplier=Future+Electronics; ComponentLink2Description: https://datasheet.ciiva.com/16320/littelfuse-fuse-369-16320426.pdf?src-supplier=Future+Electronics; ComponentLink3Description: Link Digikey; ComponentLink3URL: https://www.digikey.com/en/products/detail/littelfuse-inc/36911000000/1986930
IC1 = OPAM; SMD; LM324DR: Quad 30-V 1.2-MHz operational amplifier 14-SOIC 0 to 70; Manufacturer: Texas Instruments; Common Mode Rejection Ratio: 65dB; Number of Channels: 4; Output Current: 30mA; Max Supply Voltage: 32V; Min Supply Voltage: 3V; Slew Rate: 0.5V/µs; Min Dual Supply Voltage: 1.5V; Max Dual Supply Voltage: 16V; Voltage Gain: 100dB; Unity Gain Bandwidth Product: 1.2MHz; Input Offset Voltage (Vos): 7mV; Input Bias Current: 250nA; Operating Supply Current: 1.4mA; Output Current per Channel: 40mA; Supply Current: 3mA; Designer: TVBac; Supplier: Digikey; Supplier Part Number: 296-14597-1-ND; Manufacturer Part Number: LM324DR; RoHS: Yes; Category: Amplifiers - Op Amps, Buffer, Instrumentation; Stock: 58799; Pricing: 1=0.23, 10=0.152, 25=0.132, 100=0.1105, 250=0.10008, 500=0.09382, 1000=0.08867, 2500=0.08322, 5000=0.07994, 7500=0.0783, 12500=0.07647, 17500=0.07541, 25000=0.07438, 62500=0.07218, 125000=0.07085 (USD); Mounting Technology: Surface Mount; Case/Package: SOIC; Pins: 14; Min Operating Temperature: 0°C; Max Operating Temperature: 70°C; Package Quantity: 2500; Packaging: Tape and Reel; Bandwidth: 1.2MHz; Operating Supply Voltage: 16V; Gain Bandwidth Product: 1.2MHz; Number of Circuits: 4; Number of Amplifiers: 4; Number of Elements: 4; Series: -; Amplifier Type: GENERAL PURPOSE; Technology: BIPOLAR; Thickness: 1.58mm; Radiation Hardening: No; Reach SVHC Compliant: No; Lead Free: Lead Free; RoHS Compliant: Yes; ComponentLink1URL: https://datasheet.ciiva.com/34301/902590-34301708.pdf?src-supplier=Jameco; ComponentLink1Description: https://datasheet.ciiva.com/34301/902590-34301708.pdf?src-supplier=Jameco; ComponentLink2URL: https://datasheet.ciiva.com/1795/lm224-1795532.pdf?src-supplier=Digikey; ComponentLink2Description: https://datasheet.ciiva.com/1795/lm224-1795532.pdf?src-supplier=Digikey; ComponentLink3URL: https://datasheet.ciiva.com/1795/lm224-1795533.pdf?src-supplier=Digikey; ComponentLink3Description: https://datasheet.ciiva.com/1795/lm224-1795533.pdf?src-supplier=Digikey; ComponentLink4URL: https://datasheet.ciiva.com/1795/lm224-1795534.pdf?src-supplier=Digikey; ComponentLink4Description: https://datasheet.ciiva.com/1795/lm224-1795534.pdf?src-supplier=Digikey; ComponentLink5URL: https://datasheet.ciiva.com/5997/1768103-5997421.pdf?src-supplier=Farnell; ComponentLink5Description: https://datasheet.ciiva.com/5997/1768103-5997421.pdf?src-supplier=Farnell; ComponentLink6URL: https://datasheet.ciiva.com/2973/lm324ka-2973348.pdf?src-supplier=Avnet; ComponentLink6Description: https://datasheet.ciiva.com/2973/lm324ka-2973348.pdf?src-supplier=Avnet; ComponentLink7URL: https://datasheet.ciiva.com/7709/1840878-7709814.pdf?src-supplier=Element14; ComponentLink7Description: https://datasheet.ciiva.com/7709/1840878-7709814.pdf?src-supplier=Element14; ComponentLink8URL: https://datasheet.ciiva.com/46385/1877076-46385751.pdf?src-supplier=Element14; ComponentLink8Description: https://datasheet.ciiva.com/46385/1877076-46385751.pdf?src-supplier=Element14; ComponentLink9Description: Link Digikey; ComponentLink9URL: https://www.digikey.kr/en/products/detail/texas-instruments/LM324DR/555719
IC2 = ADE7753ARSZ: Single Phase Multifunction Metering IC 20-Pin SSOP Tube; Manufacturer: Analog Devices; Designer: TVBac; Supplier: Mouser; Supplier Part Number: 584-ADE7753ARSZ; Manufacturer Part Number: ADE7753ARSZ; RoHS: Yes; Category: Analog to Digital Converters (ADCs); Stock: 239; Pricing: 1=7.3, 10=5.71, 50=5.04, 100=3.91, 1000=3.51, 10000=3.37 (USD); ComponentLink1URL: https://datasheet.ciiva.com/15373/ade7753-249340-15373717.pdf?src-supplier=Mouser; ComponentLink1Description: https://datasheet.ciiva.com/15373/ade7753-249340-15373717.pdf?src-supplier=Mouser; ComponentLink2URL: https://datasheet.ciiva.com/1166/1610806-1166771.pdf?src-supplier=Element14; ComponentLink2Description: https://datasheet.ciiva.com/1166/1610806-1166771.pdf?src-supplier=Element14; ComponentLink3URL: https://datasheet.ciiva.com/15134/getdatasheetpartid-132040-15134272.pdf?src-supplier=Verical; ComponentLink3Description: https://datasheet.ciiva.com/15134/getdatasheetpartid-132040-15134272.pdf?src-supplier=Verical; ComponentLink4URL: https://datasheet.ciiva.com/1941/ade7753-1941429.pdf?src-supplier=Digikey; ComponentLink4Description: https://datasheet.ciiva.com/1941/ade7753-1941429.pdf?src-supplier=Digikey; ComponentLink5URL: https://datasheet.ciiva.com/22621/1610806-22621637.pdf?src-supplier=Element14; ComponentLink5Description: https://datasheet.ciiva.com/22621/1610806-22621637.pdf?src-supplier=Element14; ComponentLink6URL: https://datasheet.ciiva.com/3148/ade7753-3148700.pdf?src-supplier=Avnet; ComponentLink6Description: https://datasheet.ciiva.com/3148/ade7753-3148700.pdf?src-supplier=Avnet; ComponentLink7URL: https://datasheet.ciiva.com/1168/1610806-1168083.pdf?src-supplier=Element14; ComponentLink7Description: https://datasheet.ciiva.com/1168/1610806-1168083.pdf?src-supplier=Element14; ComponentLink8URL: https://datasheet.ciiva.com/5697/ade7753-5697029.pdf?src-supplier=Farnell; ComponentLink8Description: https://datasheet.ciiva.com/5697/ade7753-5697029.pdf?src-supplier=Farnell; ComponentLink9URL: https://datasheet.ciiva.com/48694/001249930-da-01-en-ic-energy-meteri-ade7753arsz-ssop-20-adi-48694326.pdf?src-supplier=Conrad; ComponentLink9Description: https://datasheet.ciiva.com/48694/001249930-da-01-en-ic-energy-meteri-ade7753arsz-ssop-20-adi-48694326.pdf?src-supplier=Conrad; ComponentLink10Description: Link Digikey; ComponentLink10URL: https://www.digikey.com/en/products/detail/analog-devices-inc/ADE7753ARSZ/671181
IC3 = LNK364GN-TL: AC to DC Switching Converter Off-Line Switcher 140kHz 7-Pin SMD-B / IC OFFLINE SWIT HV 8SMD; Manufacturer: Power Integrations; Designer: TVBac; Supplier: Digikey; Supplier Part Number: 596-1089-1-ND; Manufacturer Part Number: LNK364GN-TL; RoHS: Yes; Category: Voltage Regulators - Switching; Stock: 726; Pricing: 1=0.87, 100=0.7168 (USD); ComponentLink1URL: https://datasheet.ciiva.com/1930/lnk362-364-1930587.pdf?src-supplier=Digikey; ComponentLink1Description: https://datasheet.ciiva.com/1930/lnk362-364-1930587.pdf?src-supplier=Digikey; ComponentLink2URL: https://datasheet.ciiva.com/1930/lnk362-364-1930588.pdf?src-supplier=Digikey; ComponentLink2Description: https://datasheet.ciiva.com/1930/lnk362-364-1930588.pdf?src-supplier=Digikey; ComponentLink3URL: https://datasheet.ciiva.com/1930/lnk362-364-1930589.pdf?src-supplier=Digikey; ComponentLink3Description: https://datasheet.ciiva.com/1930/lnk362-364-1930589.pdf?src-supplier=Digikey; ComponentLink4URL: https://datasheet.ciiva.com/12230/lnk362-364-3310-12230262.pdf?src-supplier=Mouser; ComponentLink4Description: https://datasheet.ciiva.com/12230/lnk362-364-3310-12230262.pdf?src-supplier=Mouser; ComponentLink5Description: Link Digikey; ComponentLink5URL: https://www.digikey.com/en/products/detail/power-integrations/LNK364GN-TL/1007182
IC4 = TL431AIDBZR; MIRROID;: V-Ref Adjustable 2.495V to 36V 100mA Automotive 3-Pin SOT-23 T/R; Manufacturer: Texas Instruments; Max Supply Voltage: 37V; Number of Channels: 1; Temperature Coefficient: 92ppm/°C; Cathode Current: 700uA; Reference Type: Shunt,Adjustable; Designer: TVBac; Supplier: Mouser; Supplier Part Number: 595-TL431AIDBZR; Manufacturer Part Number: TL431AIDBZR; RoHS: Yes; Category: Voltage References; Stock: 734349; Pricing: 1=0.25, 10=0.142, 50=0.142, 100=0.101, 1000=0.095, 10000=0.08 (USD); Case/Package: SOT-23; Pins: 3; Min Operating Temperature: -40°C; Max Operating Temperature: 125°C; Min Input Voltage: 2.495V; Packaging: Tape and Reel; Output Voltage: 36V; Package Quantity: 1; Tolerance: 1%; Max Output current: 100mA; Output Current: 100mA; Min Output Voltage: 2.495V; Max Output Voltage: 36V; Reference Voltage: 36V; Series: -; Output Type: Adjustable; Radiation Hardening: No; Reach SVHC Compliant: No; Lead Free: Lead Free; RoHS Compliant: Yes; ComponentLink1URL: https://datasheet.ciiva.com/3235/tl432b-3235600.pdf?src-supplier=Avnet; ComponentLink1Description: https://datasheet.ciiva.com/3235/tl432b-3235600.pdf?src-supplier=Avnet; ComponentLink2URL: https://datasheet.ciiva.com/15148/getdatasheetpartid-171576-15148968.pdf?src-supplier=Verical; ComponentLink2Description: https://datasheet.ciiva.com/15148/getdatasheetpartid-171576-15148968.pdf?src-supplier=Verical; ComponentLink3URL: https://datasheet.ciiva.com/41462/001014548-da-01-en-ic-vref-shunt-prec-tl431aidbzr-sot-3-tid-41462400.pdf?src-supplier=Conrad; ComponentLink3Description: https://datasheet.ciiva.com/41462/001014548-da-01-en-ic-vref-shunt-prec-tl431aidbzr-sot-3-tid-41462400.pdf?src-supplier=Conrad; ComponentLink4URL: https://datasheet.ciiva.com/46397/1887475-46397705.pdf?src-supplier=Element14; ComponentLink4Description: https://datasheet.ciiva.com/46397/1887475-46397705.pdf?src-supplier=Element14; ComponentLink5URL: https://datasheet.ciiva.com/2006/tl431a-2006188.pdf?src-supplier=Digikey; ComponentLink5Description: https://datasheet.ciiva.com/2006/tl431a-2006188.pdf?src-supplier=Digikey; ComponentLink6URL: https://datasheet.ciiva.com/2006/tl431a-2006187.pdf?src-supplier=Digikey; ComponentLink6Description: https://datasheet.ciiva.com/2006/tl431a-2006187.pdf?src-supplier=Digikey; ComponentLink7URL: https://datasheet.ciiva.com/2006/tl431a-2006189.pdf?src-supplier=Digikey; ComponentLink7Description: https://datasheet.ciiva.com/2006/tl431a-2006189.pdf?src-supplier=Digikey; ComponentLink8Description: Link Digikey; ComponentLink8URL: https://www.digikey.com/en/products/detail/texas-instruments/TL431AIDBZR/686856
IC5 = ISO; 1CH; EL357N-G: Transistor Output Optocoupler, 1-Element, 3750V Isolation; Manufacturer: Everlight; Supplier: Digikey; Supplier Part Number: 1080-1037-ND; Manufacturer Part Number: EL357N-G; RoHS: Yes; Category: Optocouplers; Stock: 137; Pricing: 1=0.7, 10=0.416, 100=0.2729, 500=0.2168, 1000=0.19958, 2000=0.18548, 5000=0.17066, 10000=0.16177, 25000=0.15242 (USD); ComponentLink1URL: https://datasheet.ciiva.com/2086/201407061738295695-2086633.pdf?src-supplier=Digikey; ComponentLink1Description: https://datasheet.ciiva.com/2086/201407061738295695-2086633.pdf?src-supplier=Digikey
IC8 = LDO; 3V3; 1A; SMD; AZ1117EH-3.3TRG1: Linear Voltage Regulator IC 1 Output 1A SOT-223; MF: Diodes Inc.; Designer: TVBac; Package: SOT-223 Diodes Inc.; Value: *; Price: None; MP: AZ1117EH-3.3TRG1; SnapEDA_Link: https://www.snapeda.com/parts/AZ1117EH-3.3TRG1/Diodes%20Inc./view-part/482930/?ref=snap; Availability: Unavailable; ComponentLink1Description: Link Digikey; ComponentLink1URL: https://www.digikey.com/en/products/detail/diodes-incorporated/AZ1117EH-3-3TRG1/5001329
IC9 = LDO; 5V; 1A; BA17805FP-E2: Linear Voltage Regulator, Fixed, Positive Output, 7.5 V to 25 V, 5V, 1A, 3 Pins, TO-252 (DPAK); Manufacturer: Rohm; Number of Channels: 1NUMBER; Watchdog Timer: 5511WatchdogTimer; Designer: TVBac; Supplier: Mouser; Supplier Part Number: 755-BA17805FP-E2; Manufacturer Part Number: BA17805FP-E2; RoHS: Yes; Category: Voltage Regulators - Linear; Stock: 4846; Pricing: 1=0.82, 10=0.599, 50=0.599, 100=0.411, 1000=0.336, 10000=0.251 (USD); Lead Free: 5697LeadFree; ComponentLink1URL: https://datasheet.ciiva.com/23912/1747296-23912291.pdf?src-supplier=Newark; ComponentLink1Description: https://datasheet.ciiva.com/23912/1747296-23912291.pdf?src-supplier=Newark; ComponentLink2URL: https://datasheet.ciiva.com/26878/getdatasheetpartid-477305-26878653.pdf?src-supplier=Verical; ComponentLink2Description: https://datasheet.ciiva.com/26878/getdatasheetpartid-477305-26878653.pdf?src-supplier=Verical; ComponentLink3URL: https://datasheet.ciiva.com/22732/1747296-22732780.pdf?src-supplier=Element14; ComponentLink3Description: https://datasheet.ciiva.com/22732/1747296-22732780.pdf?src-supplier=Element14; ComponentLink4URL: https://datasheet.ciiva.com/6594/ba178-series-j-6594060.pdf?src-supplier=Digikey; ComponentLink4Description: https://datasheet.ciiva.com/6594/ba178-series-j-6594060.pdf?src-supplier=Digikey; ComponentLink5URL: https://datasheet.ciiva.com/6594/ba178-series-j-6594061.pdf?src-supplier=Digikey; ComponentLink5Description: https://datasheet.ciiva.com/6594/ba178-series-j-6594061.pdf?src-supplier=Digikey; ComponentLink6URL: https://datasheet.ciiva.com/6594/ba178-series-j-6594062.pdf?src-supplier=Digikey; ComponentLink6Description: https://datasheet.ciiva.com/6594/ba178-series-j-6594062.pdf?src-supplier=Digikey; ComponentLink7Description: Link Digikey; ComponentLink7URL: https://www.digikey.com/en/products/detail/rohm-semiconductor/BA17805FP-E2/658261
IN1 IN2 = INPUT-2.0x3.5: Designer: TVBac
J1 = HEADER; 4PIN; 2.54; VER; TSW-104-14-L-S: Conn Unshrouded Header HDR 4 POS 2.54mm Solder ST Thru-Hole Automotive Bulk; Manufacturer: Samtec; Designer: TVBac; Supplier: Digikey; Supplier Part Number: SAM1055-04-ND; Manufacturer Part Number: TSW-104-14-L-S; RoHS: Yes; Category: Connectors; Stock: 1246; Pricing: 1=0.43, 10=0.377, 100=0.3107, 500=0.2702, 1000=0.22291, 5000=0.19589, 10000=0.18238 (USD); ComponentLink1URL: https://datasheet.ciiva.com/25618/0900766b81154476-25618487.pdf?src-supplier=Rs; ComponentLink1Description: https://datasheet.ciiva.com/25618/0900766b81154476-25618487.pdf?src-supplier=Rs; ComponentLink2URL: https://datasheet.ciiva.com/10190/htsw-th-10190703.pdf?src-supplier=Avnet; ComponentLink2Description: https://datasheet.ciiva.com/10190/htsw-th-10190703.pdf?src-supplier=Avnet; ComponentLink3Description: Link Digikey; ComponentLink3URL: https://www.digikey.com/en/products/detail/samtec-inc/TSW-104-14-L-S/1102620
J6 = HEADER; 2PIN; 2.54; VER; TSW-101-15-T-D: Headers & Wire Housings Classic PCB Header Strips, 0.100 pitch; Manufacturer: Samtec; Designer: TVBac; Supplier: Arrow Electronics; Supplier Part Number: TSW-101-15-T-D; Manufacturer Part Number: TSW-101-15-T-D; RoHS: Yes; Category: Connectors; Stock: 4464; Pricing: 1=0.18, 50=0.14, 100=0.12, 500=0.1, 1000=0.07, 2000=0.06, 5000=0.05 (USD); ComponentLink1URL: https://datasheet.ciiva.com/10283/htsw-th-10283318.pdf?src-supplier=Avnet; ComponentLink1Description: https://datasheet.ciiva.com/10283/htsw-th-10283318.pdf?src-supplier=Avnet; ComponentLink2Description: Link Digikey; ComponentLink2URL: https://www.digikey.com/en/products/detail/samtec-inc/TSW-101-15-T-D/7861723
K1 K2 = RELAY; SINGLE; 20A; 12VDC; G4A-1A-E-DC12: Electromechanical Relay 12VDC 160Ohm 20A SPST-NO (30.5x16x33.5)mm THT Power Relay; Manufacturer: Omron; Designer: TVBac; Supplier: Arrow Electronics; Supplier Part Number: G4A-1A-E DC12; Manufacturer Part Number: G4A-1A-E-DC12; RoHS: Yes; Category: Power Relays; Stock: 19; Pricing: 19=4.336 (USD); ComponentLink1URL: https://datasheet.ciiva.com/22829/0900766b8002b917-22829163.pdf?src-supplier=Rs; ComponentLink1Description: https://datasheet.ciiva.com/22829/0900766b8002b917-22829163.pdf?src-supplier=Rs; ComponentLink2Description: Link Digikey; ComponentLink2URL: https://www.digikey.com/en/products/detail/omron-electronics-inc-emc-div/G4A-1A-E-DC12/202598
L1 L2 = IND; 220uH; 250mA; ASPI-0418FS-221M-T3: Power Inductor (SMD), 220 uH, ± 20%, 250 mA, Shielded, 330 mA, 4mm x 4mm x 1.8mm; Manufacturer: Abracon; Designer: TVBac; Supplier: Mouser; Supplier Part Number: 815-ASPI0418FS221MT3; Manufacturer Part Number: ASPI-0418FS-221M-T3; RoHS: No; Category: Fixed Inductors; Stock: 2874; Pricing: 1=0.36, 10=0.234, 50=0.234, 100=0.182, 1000=0.163, 10000=0.127 (USD); ComponentLink1URL: https://abracon.com/Magnetics/new/ASPI-0418FS.pdf?src-supplier=Digikey; ComponentLink1Description: https://abracon.com/Magnetics/new/ASPI-0418FS.pdf?src-supplier=Digikey; ComponentLink2Description: Link Digikey; ComponentLink2URL: https://www.digikey.com/en/products/detail/abracon-llc/ASPI-0418FS-221M-T3/10273501
M1 = ESP32-WROOM-WROVE-32E-H4; SMD;: Rf Txrx Module Bt Trace Ant SMD; Manufacturer: Espressif Systems; Manufacturer Part Number: ESP32-WROOM-32E-H4; Designer: TVBac; Supplier: Digikey; Supplier Part Number: 1965-ESP32-WROOM-32E-H4CT-ND; RoHS: No; Category: LDO; Stock: 7552; Pricing: 1=2.68 (USD); ComponentLink1Description: Link Datasheet; ComponentLink1URL: https://www.espressif.com/sites/default/files/documentation/esp32-wroom-32e_esp32-wroom-32ue_datasheet_en.pdf; ComponentLink2Description: Link Digikey; ComponentLink2URL: https://www.digikey.com/en/products/detail/espressif-systems/ESP32-WROOM-32E-H4/12696413